# Altium project PCB_Project.PrjPcb
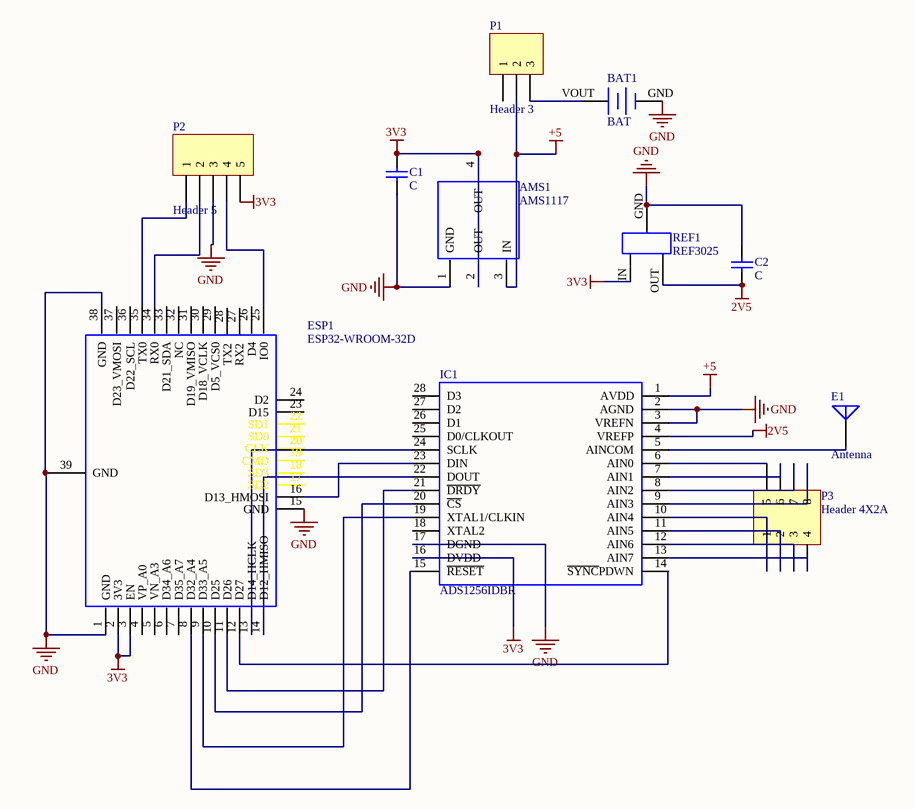
[diagram p0: Main.SchDoc]
1 sheet, 11 parts. Net scope: global (net labels, ports and power ports of the same name join across sheets).

## Sheet Main.SchDoc
size A

### Parts
AMS1  AMS1117  [AMS1117]
BAT1  BAT  [CHARGER]
C1  C  [C0805]
C2  C  [C0805]
E1  Antenna  [1P]
ESP1  ESP32-WROOM-32D  [ESP32WROOM32D]
IC1  ADS1256IDBR  [ADS1256IDBR]
P1  Header 3  [3P_SWITCH]
P2  Header 5  [5P]
P3  Header 4X2A  [ELECTRODE]
REF1  REF3025  [REF3025_SOT23]

### Nets
2V5: C2.1 IC1.4(VREFP) REF1.OUT
3V3: AMS1.2(OUT) AMS1.4(OUT) C1.2 ESP1.2(3V3) ESP1.3(EN) IC1.16(DVDD) P2.5 REF1.IN
+5: AMS1.3(IN) IC1.1(AVDD) P1.2
GND: AMS1.1(GND) BAT1.GND C1.1 C2.2 ESP1.1(GND) ESP1.15(GND) ESP1.38(GND) ESP1.39(GND) IC1.2(AGND) IC1.3(VREFN) IC1.17(DGND) P2.3 REF1.GND
NetBAT1_VOUT: BAT1.VOUT P1.3
NetE1_1: E1.1(A) IC1.5(AINCOM)
NetESP1_8: ESP1.8(D32_A4) IC1.15(~{RESET})
NetESP1_9: ESP1.9(D33_A5) IC1.19(XTAL1/CLKIN)
NetESP1_10: ESP1.10(D25) IC1.20(~{CS})
NetESP1_11: ESP1.11(D26) IC1.21(~{DRDY})
NetESP1_12: ESP1.12(D27) IC1.14(~{SYNC}PDWN)
NetESP1_13: ESP1.13(D14_HCLK) IC1.24(SCLK)
NetESP1_14: ESP1.14(D12_HMISO) IC1.22(DOUT)
NetESP1_16: ESP1.16(D13_HMOSI) IC1.23(DIN)
NetESP1_25: ESP1.25(IO0) P2.4
NetESP1_34: ESP1.34(RX0) P2.2
NetESP1_35: ESP1.35(TX0) P2.1
NetIC1_6: IC1.6(AIN0) P3.5
NetIC1_7: IC1.7(AIN1) P3.6
NetIC1_8: IC1.8(AIN2) P3.7
NetIC1_9: IC1.9(AIN3) P3.8
NetIC1_10: IC1.10(AIN4) P3.1
NetIC1_11: IC1.11(AIN5) P3.2
NetIC1_12: IC1.12(AIN6) P3.3
NetIC1_13: IC1.13(AIN7) P3.4

Not connected (* = marked no-connect by the designer): ESP1 4(VP_A0) 5(VN_A3) 6(D34_A6) 7(D35_A7) 17(SD2) 18(SD3) 19(CMD) 20(CLK) 21(SD0) 22(SD1) 23(D15) 24(D2) 26(D4) 27(RX2) 28(TX2) 29(D5_VCS0) 30(D18_VCLK) 31(D19_VMISO) 32(NC) 33(D21_SDA) 36(D22_SCL) 37(D23_VMOSI); IC1 18(XTAL2) 25(D0/CLKOUT) 26(D1) 27(D2) 28(D3); P1 1

### Library data of the parts
E1 = Antenna: Generic Antenna; Published: 24-Mar-1999; LatestRevisionDate: 17-Jul-2002; LatestRevisionNote: Re-released for DXP Platform.; PackageReference: PIN1; Publisher: Altium Limited
IC1 = ADS1256IDBR: Integrated Circuit; Manufacturer_Name: Texas Instruments; Datasheet Link: http://www.ti.com/lit/gpn/ads1256; Height: 2mm; Manufacturer_Part_Number: ADS1256IDBR; Mouser Part Number: 595-ADS1256IDBR; Mouser Price/Stock: https://www.mouser.com/Search/Refine.aspx?Keyword=595-ADS1256IDBR
P1 = Header 3: Header, 3-Pin; LatestRevisionDate: 17-Jul-2002; LatestRevisionNote: Re-released for DXP Platform.; Publisher: Altium Limited
P2 = Header 5: Header, 5-Pin; LatestRevisionDate: 17-Jul-2002; LatestRevisionNote: Re-released for DXP Platform.; Publisher: Altium Limited
P3 = Header 4X2A: Header, 4-Pin, Dual row; LatestRevisionDate: 17-Jul-2002; LatestRevisionNote: Re-released for DXP Platform.; Publisher: Altium Limited
AMS1 = AMS1117: Published: 8-Jun-2000; LatestRevisionDate: 17-Jul-2002; LatestRevisionNote: Re-released for DXP Platform.; DatasheetVersion: Sep-1997; PackageVersion: revC; PackageReference: ZZ311; Publisher: Altium Limited; PackageDescription: SOT-223/SC-73; 4 Leads; Body 6.7 x 7.3 mm, inc. leads (LxW max); ComponentLink1Description: Manufacturer Link; ComponentLink1URL: http://www.ti.com/; ComponentLink2Description: Datasheet; ComponentLink2URL: http://www-s.ti.com/sc/ds/REG1117.pdf
BAT1 = BAT: Published: 24-Mar-1999; LatestRevisionDate: 17-Jul-2002; LatestRevisionNote: Re-released for DXP Platform.; PackageReference: BAT-2; Publisher: Altium Limited; PackageDescription: Battery; 2 Leads
C1 C2 = C: Published: 8-Jun-2000; LatestRevisionDate: 17-Jul-2002; LatestRevisionNote: Re-released for DXP Platform.; PackageReference: RAD-0.3; Publisher: Altium Limited; PackageDescription: Radial Cap, Thru-Hole; 2 Leads; 0.3 in Pin Spacing
ESP1 = ESP32-WROOM-32D: LatestRevisionDate: 17-Jul-2002; LatestRevisionNote: Re-released for DXP Platform.; Publisher: Altium Limited